# Altium schematic sheet 12to5VSwitcher-3A.SCHDOC
size A4; Organization: UNSW Solar Racing Team; Address3: UNSW; Address4: Sydney NSW 2052; Address2: Electrical Engineering; Address1: Rm 109
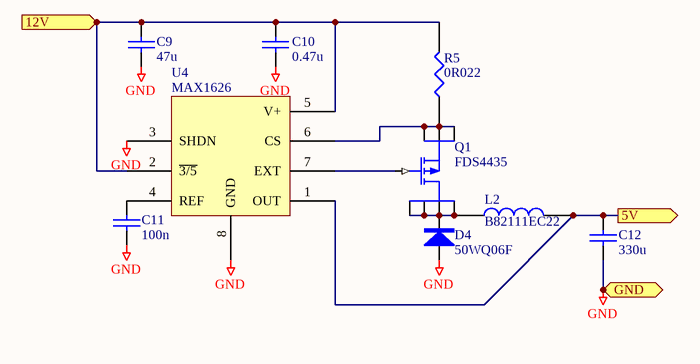
[diagram p0: 12to5VSwitcher-3A.SCHDOC]

## Parts
C9  47u  [KEMET_CASED]
C10  0.47u  [1206]
C11  100n  [0603]
C12  330u  [KEMET_CASED]
D4  50WQ06F  [DPAK]
L2  B82111EC22  [PCH-45]
Q1  FDS4435  [SO8]
R5  0R022  [2512]
U4  MAX1626  [SO8]

## Ports
5V (out), 12V (in), GND (bidir)

## Nets
GND: C9.2 C10.2 C11.2 C12.2 D4.1(A) U4.3(SHDN) U4.8(GND) ; port GND
5V: C12.1 L2.2 U4.1(OUT) ; port 5V
12V: C9.1 C10.1 R5.2 U4.2(~{3/5}) U4.5(V+) ; port 12V
NetC11_1: C11.1 U4.4(REF)
NetD4_2: D4.2(K) L2.1 Q1.5(D) Q1.6(D) Q1.7(D) Q1.8(D)
NetQ1_1: Q1.1(S) Q1.2(S) Q1.3(S) R5.1 U4.6(CS)
NetQ1_4: Q1.4(G) U4.7(EXT)

## Notes on the sheet
- Title
- Size:
- Date:
- A4
- Number:
- Time:
- Revision:
- Sheet
- of
- File:

## Library data of the parts
C9-C12 = CAP: Capacitor
  C9: Farnell: 1601655; Price: 1.29; Digikey: 495-1544-1-ND; DigikeyPrice: 0.87
  C10: FarnellPrice: 0.668; OldFarnell: 757-688; Farnell: 4900388
  C11: Farnell: have; Price: 0
  C12: Farnell: 1183405; FarnellPrice: 2.60; Digikey: 399-3884-1-ND; DigikeyPrice: 2.1
D4 = 50WQ06F: Diode; Farnell: 9101314; Price: 2.99
L2 = INDUCTOR: Digikey: 608671; DigikeyPrice: 1.24
Q1 = SI4425DY: FDS4435P Channel Mosfet; Farnell: 9846204; Price: 2.99; Digikey: FDS4435BZCT-ND; DigikeyPrice: 0.8
R5 = RES1: DigikeyPrice: 2.805; Digikey: RL32T.022GCT-ND
U4 = MAX1626: Farnell: 9725342; FarnellPrice: 9.09; Digikey: MAX1626ESA+-ND; DigikeyPrice: 4.61